# EAGLE design Lighthouse Sensor (EAGLE 9.6.2)
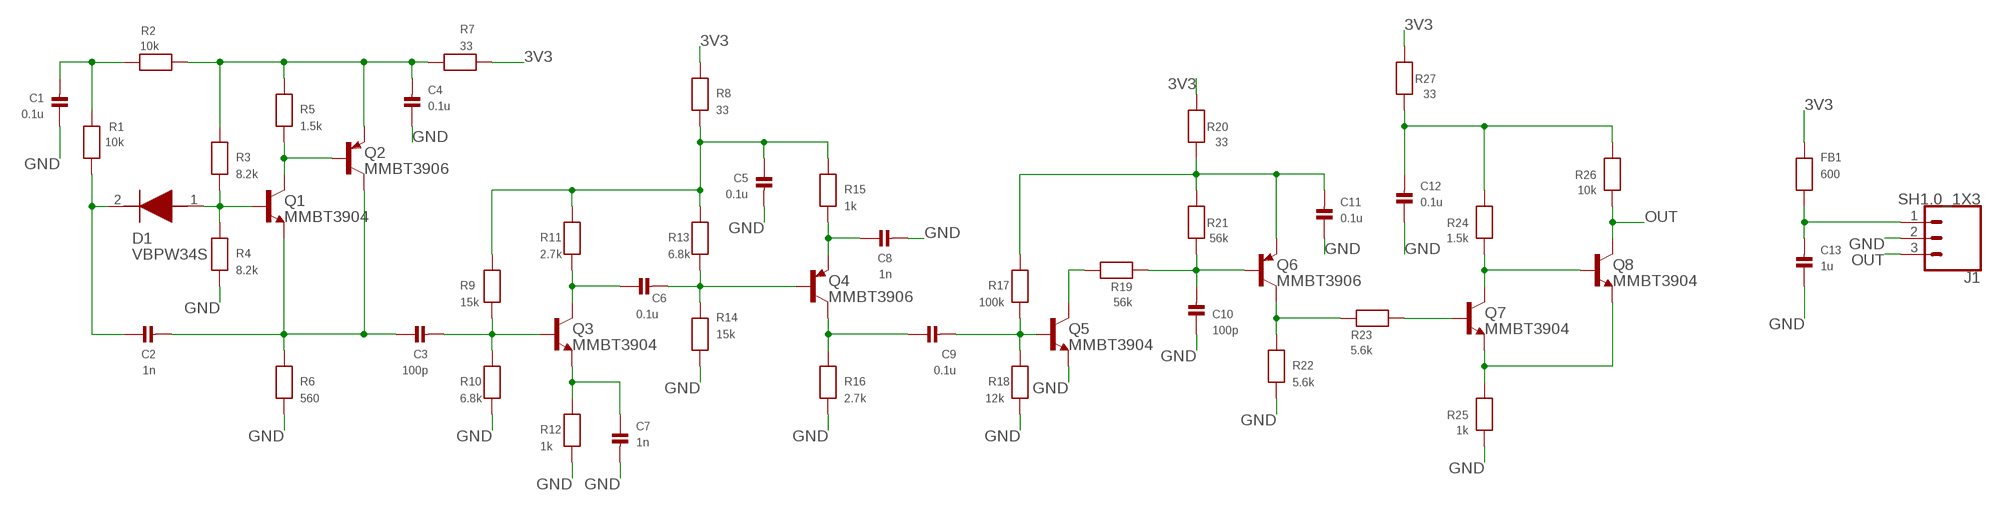
[diagram p0: schematic, sheet 1]

## Parts
C1  0.1u  CAP_CERAMIC_C0603  [C0603]
C2  1n  CAP_CERAMIC_C0603  [C0603]
C3  100p  CAP_CERAMIC_C0603  [C0603]
C4  0.1u  CAP_CERAMIC_C0603  [C0603]
C5  0.1u  CAP_CERAMIC_C0603  [C0603]
C6  0.1u  CAP_CERAMIC_C0603  [C0603]
C7  1n  CAP_CERAMIC_C0603  [C0603]
C8  1n  CAP_CERAMIC_C0603  [C0603]
C9  0.1u  CAP_CERAMIC_C0603  [C0603]
C10  100p  CAP_CERAMIC_C0603  [C0603]
C11  0.1u  CAP_CERAMIC_C0603  [C0603]
C12  0.1u  CAP_CERAMIC_C0603  [C0603]
C13  1u  CAP_CERAMIC_C0603  [C0603]
D1  VBPW34S  [VBPW34S]
FB1  600  RESISTOR_R0603  [R0603]
J1  SH1.0_1X3  [1X03_1MM_RA]
Q1  MMBT3904  BC849SMD  [SOT23-BEC]
Q2  MMBT3906  MMBT3906LT1SMD  [SOT23-BEC]
Q3  MMBT3904  BC849SMD  [SOT23-BEC]
Q4  MMBT3906  MMBT3906LT1SMD  [SOT23-BEC]
Q5  MMBT3904  BC849SMD  [SOT23-BEC]
Q6  MMBT3906  MMBT3906LT1SMD  [SOT23-BEC]
Q7  MMBT3904  BC849SMD  [SOT23-BEC]
Q8  MMBT3904  BC849SMD  [SOT23-BEC]
R1  10k  RESISTOR_R0603  [R0603]
R2  10k  RESISTOR_R0603  [R0603]
R3  8.2k  RESISTOR_R0603  [R0603]
R4  8.2k  RESISTOR_R0603  [R0603]
R5  1.5k  RESISTOR_R0603  [R0603]
R6  560  RESISTOR_R0603  [R0603]
R7  33  RESISTOR_R0603  [R0603]
R8  33  RESISTOR_R0603  [R0603]
R9  15k  RESISTOR_R0603  [R0603]
R10  6.8k  RESISTOR_R0603  [R0603]
R11  2.7k  RESISTOR_R0603  [R0603]
R12  1k  RESISTOR_R0603  [R0603]
R13  6.8k  RESISTOR_R0603  [R0603]
R14  15k  RESISTOR_R0603  [R0603]
R15  1k  RESISTOR_R0603  [R0603]
R16  2.7k  RESISTOR_R0603  [R0603]
R17  100k  RESISTOR_R0603  [R0603]
R18  12k  RESISTOR_R0603  [R0603]
R19  56k  RESISTOR_R0603  [R0603]
R20  33  RESISTOR_R0603  [R0603]
R21  56k  RESISTOR_R0603  [R0603]
R22  5.6k  RESISTOR_R0603  [R0603]
R23  5.6k  RESISTOR_R0603  [R0603]
R24  1.5k  RESISTOR_R0603  [R0603]
R25  1k  RESISTOR_R0603  [R0603]
R26  10k  RESISTOR_R0603  [R0603]
R27  33  RESISTOR_R0603  [R0603]

## Nets
3V3 [POWER]: FB1.2 R7.2 R8.1 R20.2 R27.2
GND: C1.1 C4.1 C5.2 C7.2 C8.2 C10.1 C11.1 C12.1 C13.1 J1.2 Q5.E R4.2 R6.2 R10.2 R12.2 R14.2 R16.2 R18.2 R22.1 R25.2
N$1: C1.2 R1.2 R2.2
N$2: C2.1 D1.2(K) R1.1
N$3: D1.1(A) Q1.B R3.2 R4.1
N$4: C4.2 Q2.E R2.1 R3.1 R5.1 R7.1
N$5: Q1.C Q2.B R5.2
N$6: C11.2 Q6.E R17.1 R20.1 R21.2
N$7: C5.1 R8.2 R9.1 R11.1 R13.1 R15.1
N$8: C3.2 Q3.B R9.2 R10.1
N$9: C2.2 C3.1 Q1.E Q2.C R6.1
N$10: C6.2 Q4.B R13.2 R14.1
N$11: C6.1 Q3.C R11.2
N$12: C7.1 Q3.E R12.1
N$13: C9.2 Q5.B R17.2 R18.1
N$14: C8.1 Q4.E R15.2
N$15: C9.1 Q4.C R16.1
N$16: Q6.C R22.2 R23.2
N$17: C10.2 Q6.B R19.2 R21.1
N$18: Q5.C R19.1
N$19: Q7.B R23.1
N$20: Q7.E Q8.E R25.1
N$21: Q7.C Q8.B R24.2
N$22: C13.2 FB1.1 J1.1
N$25: C12.2 R24.1 R26.1 R27.1
OUT: J1.3 Q8.C R26.2

## Library data of the parts
C1-C13 = Anran_microbuilder:CAP_CERAMIC: Ceramic Capacitors 0402 - 0402 Surface Mount Capacitors 0603 - 0603 Surface Mount Capacitors 0805 - 0805 Surface Mount Capacitors 1206 - 1206 Surface Mount Capacitors
D1 = VBPW34S:VBPW34S: Photodiode PIN Chip 940nm 2-Pin SMD T/R Source: Datasheet <https://componentsearchengine.com/Datasheets/2/VBPW34S.pdf>; ARROW_PART_NUMBER: VBPW34S; ARROW_PRICE-STOCK: https://www.arrow.com/en/products/vbpw34s/vishay?region=nac; DESCRIPTION: Photodiode PIN Chip 940nm 2-Pin SMD T/R; HEIGHT: 1.3mm; MANUFACTURER_NAME: Vishay; MANUFACTURER_PART_NUMBER: VBPW34S; MOUSER_PART_NUMBER: 782-VBPW34S; MOUSER_PRICE-STOCK: https://www.mouser.co.uk/ProductDetail/Vishay-Semiconductors/VBPW34S?qs=Uj7aA%252BCqp8ZDwjFKEZ8K8A%3D%3D
FB1 R1-R27 = Anran_microbuilder:RESISTOR: Resistors 0402 - 0402 Surface Mount Package 0603 - 0603 Surface Mount Package 0805 - 0805 Surface Mount Package 1206 - 1206 Surface Mount Package 2012 - 2010 Surface Mount Package
J1 = customCON:SH1.0_1X3; SPICEPREFIX: J
Q1 Q3 Q5 Q7 Q8 = transistor-npn:BC849*: NPN Transistor
Q2 Q4 Q6 = transistor-pnp:MMBT3906*: PNP Transistror

## Net classes
0 default: width 0.152 mm, drill 0.3 mm, clearance 0.152 mm
1 POWER: width 0.152 mm, drill 0.3 mm, clearance 0.152 mm

## Board
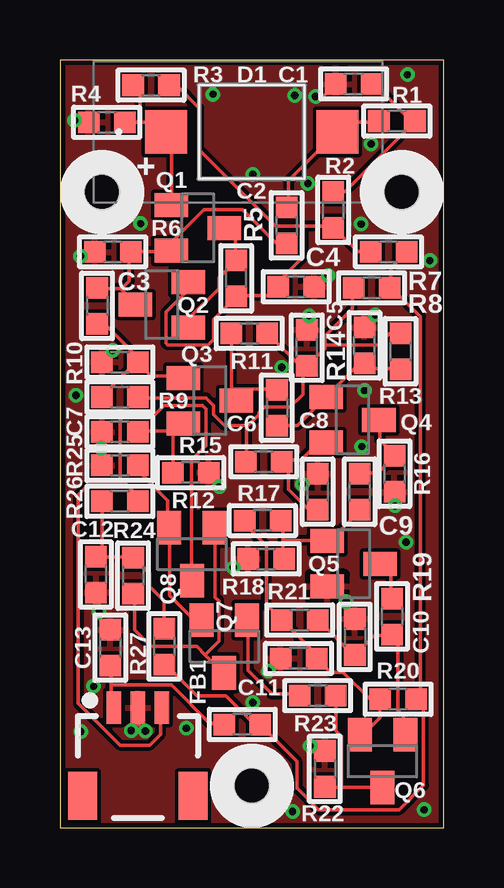
[diagram p1: board, top side]
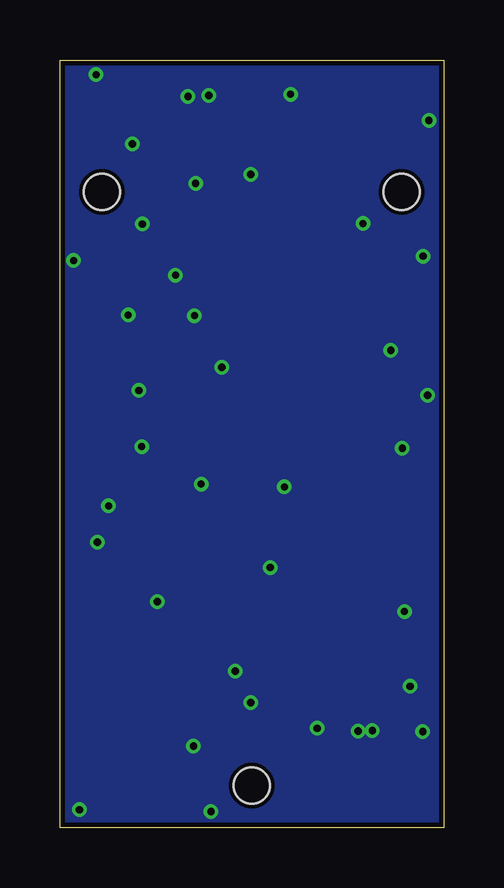
[diagram p2: board, bottom side, seen from below]

Size 16 x 32 mm. Coordinates in mm from the lower left corner, seen from the top.
Outline: 0,32 0,0 16,0 16,32 0,32
Copper layers (1*16): Top 0.035mm / dielectric 0.73mm / Bottom 0.035mm
Design rules "standard2layer *": minimum track width 6mil, minimum drill 0.3mm, track to track 6mil, track to pad 6mil, pad to pad 6mil, via to via 6mil, smd to smd 0mil, copper to edge 8mil, drill to drill 10mil, minimum pad ring 6mil, minimum via ring 6mil, stop-mask expansion 4mil, vias tented up to drill 0.3mm, thermal gap 10mil
Holes 1.5 mm at 1.75,26.5 8,1.75 14.25,26.5

### Footprints (pad centres in the part's own frame; a part is rotated, then mirrored left to right if it is on the bottom)
C0603 = smd 0.9 x 0.9: 1 -0.75,0; 2 0.75,0
VBPW34S = smd 1.75 x 1.8: 1 -3.575,0; 2 3.575,0
R0603 = smd 0.9 x 0.9: 1 -0.75,0; 2 0.75,0
1X03_1MM_RA = smd 0.6 x 1.35: 1 -1,0; 2 0,0; 3 1,0 | smd 1.2 x 2: NC1 2.3,-3.675; NC2 -2.3,-3.675
SOT23-BEC = smd 1 x 1.4: B -0.95,-1.1; C 0,1.1; E 0.95,-1.1

### Placement (x,y rotation side)
C1  12.25,31 0 top
C2  9.45,25.1 270 top
C3  1.55,21.75 270 top
C4  9.85,22.55 180 top
C5  10.3,20 90 top
C6  9.05,17.5 270 top
C7  2.5,16.5 180 top
C8  10.75,14 90 top
C9  12.5,14 270 top
C10  12.3,7.95 270 top
C11  9.95,7.05 0 top
C12  1.5,10.55 90 top
C13  2.1,7.5 270 top
D1  8,29 0 top
FB1  7.6,4.3 0 top
J1  3.25,5 0 top
Q1  5.75,25 270 top
Q2  4.25,21.8 90 top
Q3  6.25,17.8 270 top
Q4  12.2,17 270 top
Q5  12.25,11 270 top
Q6  13.45,2.77 180 top
Q7  6.85,7.55 180 top
Q8  5.5,11.4 180 top
R1  14.05,29.45 0 top
R2  11.4,25.75 90 top
R3  3.8,30.95 180 top
R4  1.95,29.4 180 top
R5  7.35,22.9 90 top
R6  2.2,24 180 top
R7  13.7,24 0 top
R8  13,22.5 180 top
R9  2.5,17.95 180 top
R10  2.5,19.4 180 top
R11  7.9,20.6 180 top
R12  5.45,14.8 0 top
R13  14.2,19.85 270 top
R14  12.7,20.1 90 top
R15  8.5,15.25 0 top
R16  13.95,14.75 270 top
R17  8.45,12.8 0 top
R18  8.6,11.2 180 top
R19  13.85,8.8 270 top
R20  14.1,5.35 0 top
R21  10,8.65 180 top
R22  11.05,2.45 270 top
R23  10.75,5.5 0 top
R24  3.05,10.5 270 top
R25  2.5,15.1 180 top
R26  2.5,13.6 0 top
R27  4.35,7.55 270 top

### Tracks (layer width: path | path; a pad name or v marks a point on that pad's centre or on a via)
3V3
  Top 0.152: R7.2 14.4,23.93 13.79,23.32 13.79,22.55 R8.1 13.84,22.5 15.04,21.31 15.04,5.32 R20.2 15.16,5.35 15.16,1.75 14.15,0.74 10.79,0.74 9.9,1.63 9.88,1.63 9.88,2.77 8.38,4.27 FB1.2 8.31,4.34 8.08,4.34 6.93,5.49 5.71,5.49 4.42,6.78 R27.2
GND  (via drill 0.3)
  Top 0.152: v2.97,4.04 3.25,4.32 J1.2 3.25,4.33 v3.56,4.02 | C13.1 1.63,8.72 v1.63,9.01 1.63,9.67 C12.1 | R22.1 10.63,3.2 v10.43,3.4 | C11.1 9.2,7.03 v8.69,6.52 | C10.1 11.94,9.06 v11.94,9.42 11.31,10.05 Q5.E | R18.2 7.49,10.84 v7.23,10.84 | R12.2 6.64,14.36 v6.64,14.2 | C8.2 10.32,14.32 v10.11,14.32 | R16.2 13.97,13.98 v13.97,13.41 | C7.2 1.75,15.84 | 1.75,15.84 v1.72,15.81 | R25.2 1.75,15.84 | R10.2 1.75,19.45 v2.2,19.9 | C5.2 10.3,21.25 v10.39,21.34 | v13.15,21.37 13.15,21.3 R14.2 | C4.1 11.08,23.03 v11.18,23.03 | R6.2 1.27,23.82 v0.85,23.82 | C1.1 10.98,30.48 v10.66,30.48 | R4.2 1.12,29.48 v0.61,29.48
  other vias: 8.04,27.23 6.38,30.57 9.79,30.52 14.49,31.39 12.56,25.16 0.67,18.02 5.27,4.14 0.87,4 15.19,0.74 9.7,0.67 3.36,25.18 8.04,5.21 12.71,18.22 12.59,15.88 9.25,19.19 14.44,11.9 1.4,5.89 12.98,28.5 10.34,26.85 15.43,23.64
  pour Bottom: 0,32 16,32 16,0 0,0
  pour Top: 0,32 16,32 16,0 0,0
N$1
  Top 0.152: R2.2 11.43,26.52 11.89,26.52 14.78,29.41 R1.2 14.71,29.41 13.18,30.94 13.05,30.94 C1.2
N$2
  Top 0.152: C2.1 9.53,25.91 9.53,26.98 11.51,28.96 D1.2 11.58,29.03 11.96,29.41 13.26,29.41 R1.1
N$3
  Top 0.152: 4.65,28.8 4.5,28.96 D1.1 | 4.65,25.98 Q1.B 4.65,26.06 4.65,28.8 | 3.96,29.49 4.42,29.03 D1.1 | 3.35,29.41 3.96,29.41 D1.1 | 3.35,29.41 2.74,29.41 R4.1 | 3.35,29.41 3.35,30.88 R3.2 | 4.65,28.8 D1.1
N$4
  Top 0.152: Q2.E 5.33,22.71 5.33,22.4 4.42,21.49 4.42,20.19 4.5,20.12 6.17,20.12 6.4,20.34 6.4,21.18 7.32,22.1 R5.1 7.39,22.17 8.76,22.17 9.07,22.48 C4.2 9.14,22.55 9.14,22.78 10.13,23.77 10.13,25.07 | 10.13,25.07 11.35,25.07 R2.1 11.43,24.99 12.42,24 12.88,24 R7.1 | 10.13,25.07 8.99,25.07 5.8,28.26 5.8,30 4.9,30.9 4.8,30.9 4.8,30.79 4.72,30.78 R3.1
N$5
  Top 0.152: Q1.C 7.32,24.54 7.32,23.7 R5.2 7.32,23.62 6.63,22.94 6.63,22.48 5.41,21.26 5.41,20.88 Q2.B
N$6
  Top 0.152: Q6.E 12.65,3.89 13.34,4.57 13.34,5.33 R20.1 13.26,5.33 12.95,5.33 11.81,6.48 11.28,6.48 10.74,7.01 C11.2 10.67,7.09 10.67,7.24 9.3,8.61 R21.2 9.22,8.69 8.61,9.3 8.61,11.73 7.77,12.57 7.77,12.72 R17.1
N$7
  Top 0.152: 7.81,16.73 8.31,17.22 8.31,17.3 8.53,17.53 9.6,17.53 10.13,18.06 10.13,19.05 10.29,19.2 C5.1 | 7.81,16.73 7.77,16.69 7.77,15.32 R15.1 | R9.1 3.28,17.91 6.1,17.91 6.4,17.6 6.4,17.22 6.86,16.76 7.77,16.76 7.81,16.73 | R11.1 8.69,20.57 10.13,19.13 C5.1 | 11.05,20.12 11.05,19.96 10.36,19.28 C5.1 | 11.05,20.12 11.05,20.5 12.19,21.64 12.19,22.48 R8.2 | 11.05,20.12 13.26,20.12 13.72,20.57 14.17,20.57 R13.1
N$8
  Top 0.152: 3.2,19.43 3.2,19.66 1.91,20.95 1.6,20.95 C3.2 | 3.2,19.43 1.75,17.98 R9.2 | 3.2,19.43 R10.1 3.28,19.36 3.81,18.82 5.11,18.82 Q3.B
N$9
  Top 0.152: 2.55,22.44 3.12,21.87 Q2.C | 2.55,22.44 2.52,22.48 1.6,22.48 C3.1 | 2.55,22.44 2.9,22.78 2.9,23.93 R6.1 2.97,24 4.65,24 Q1.E 4.72,24.08 4.72,24.46 6.02,25.76 7.62,25.76 8.99,24.38 9.45,24.38 C2.2
N$10
  Top 0.152: R13.2 14.17,19.13 12.88,19.13 12.72,19.28 R14.1 12.65,19.28 12.42,19.28 11.12,17.98 Q4.B 11.05,17.91 9.91,16.76 9.07,16.76 C6.2
N$11
  Top 0.152: 7.16,18.29 7.16,17.98 7.32,17.83 Q3.C 7.16,18.29 | 7.16,18.29 7.16,20.57 R11.2 | 7.16,18.29 8.99,18.29 C6.1
N$12
  Top 0.152: 4.72,16.54 4.8,16.54 5.11,16.84 Q3.E 4.72,16.54 | 4.72,16.54 3.28,16.54 C7.1 | 4.72,16.54 4.72,14.86 R12.1
N$13
  Top 0.152: 9.3,11.96 9.3,12.65 9.22,12.72 R17.2 | 9.3,11.96 9.3,11.2 R18.1 | C9.2 12.5,13.18 11.2,11.89 Q5.B 11.12,11.96 9.3,11.96
N$14
  Top 0.152: 9.53,15.32 10.06,15.32 10.74,16 11.05,16 Q4.E | 9.53,15.32 9.3,15.32 R15.2 9.53,15.32 | 9.53,15.32 9.53,14.1 10.36,13.26 C8.1
N$15
  Top 0.152: C9.1 12.57,14.78 13.26,14.78 13.95,15.47 R16.1 13.95,15.54 13.34,16.15 13.34,16.99 Q4.C
N$16
  Top 0.152: 11.73,1.68 13.34,1.68 13.34,1.67 Q6.C | 11.73,1.68 11.12,1.68 R22.2 | 11.73,1.68 11.73,3.81 11.51,4.04 11.51,5.49 R23.2
N$17
  Top 0.152: R21.1 10.82,8.61 12.27,7.16 C10.2 12.34,7.24 13.11,8 13.79,8 R19.2 13.79,7.92 14.1,7.62 14.1,4.88 14.33,4.65 14.33,3.88 Q6.B
N$18
  Top 0.152: R19.1 13.79,9.6 13.79,10.59 13.41,10.97 Q5.C
N$19
  Top 0.152: R23.1 9.98,5.56 8.84,5.56 7.85,6.55 7.85,8.61 Q7.B
N$20
  Top 0.152: R25.1 3.28,15.09 3.28,14.86 4.5,13.64 4.5,12.57 Q8.E 4.57,12.5 4.57,9.68 5.56,8.69 5.87,8.69 Q7.E
N$21
  Top 0.152: 6.06,7.2 6.78,6.48 Q7.C | 6.06,7.2 5.71,7.54 3.81,7.54 3.12,8.23 3.12,9.68 R24.2 | 6.06,7.2 6.63,7.77 6.63,9.45 6.48,9.6 6.48,12.5 Q8.B
N$22
  Top 0.152: 2.13,5.94 2.13,5.11 2.21,5.03 J1.1 | 2.13,5.94 2.13,6.71 C13.2 | 2.13,5.94 4.65,5.94 6.25,4.34 6.78,4.34 FB1.1
N$25
  Top 0.152: R27.1 4.34,9.45 3.73,10.06 3.73,10.59 3.12,11.2 R24.1 3.05,11.28 1.75,11.28 | 1.75,11.28 1.52,11.28 C12.2 1.75,11.28 | 1.75,11.28 1.75,13.56 R26.1
OUT
  Top 0.152: 2.63,14.44 2.52,14.55 2.52,16.99 2.74,17.22 3.96,17.22 4.34,17.6 5.94,17.6 6.1,17.45 6.1,15.93 5.49,15.32 5.49,10.36 Q8.C | 2.63,14.44 3.2,13.87 3.2,13.64 R26.2 | J1.3 4.19,4.95 4.19,3.89 3.73,3.43 2.52,3.43 0.76,5.18 0.76,13.87 1.29,14.4 2.59,14.4 2.63,14.44

### Text on the board
tNames: +